# Altium schematic sheet ThePixelExpert_ESP-32-WLED-Board__PCB__Sheet_1_2025-09-09.schdoc
size 303 x 177 mm
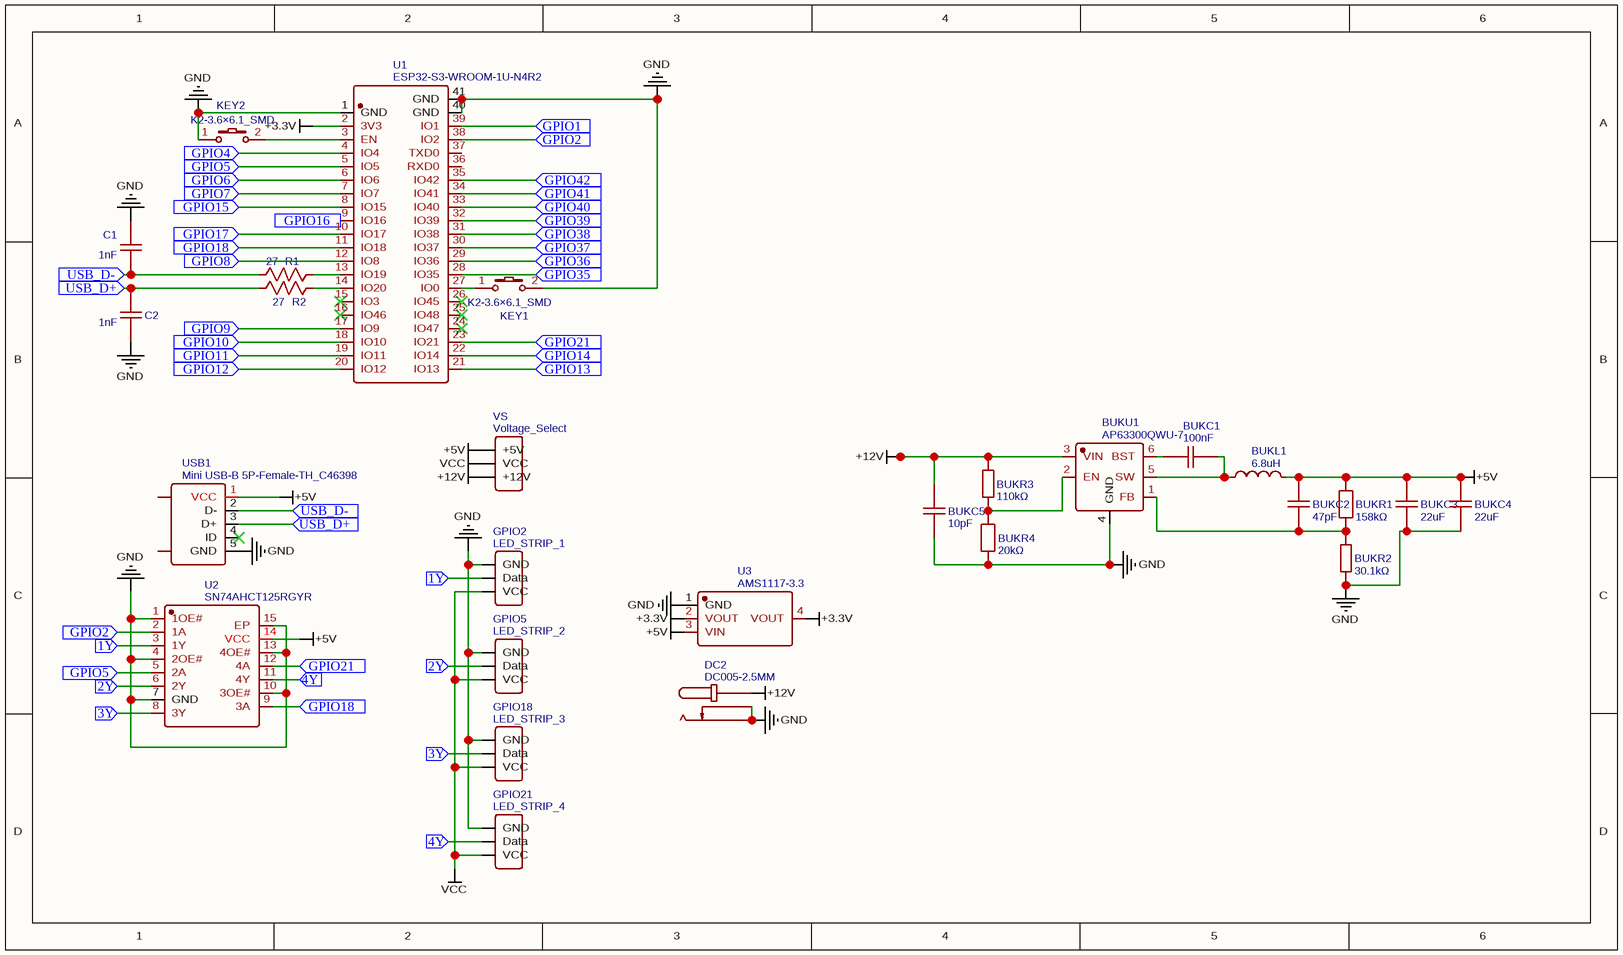
[diagram p0: ThePixelExpert_ESP-32-WLED-Board__PCB__Sheet_1_2025-09-09.schdoc]

## Parts
BUKC1  100nF  [C0603]
BUKC2  47pF  [C0603]
BUKC3  22uF  [C0603]
BUKC4  22uF  [C0603]
BUKC5  10pF  [C0603]
BUKL1  6.8uH  [L0603]
BUKR1  158kΩ  [R0603]
BUKR2  30.1kΩ  [R0603]
BUKR3  110kΩ  [R0603]
BUKR4  20kΩ  [R0603]
BUKU1  AP63300QWU-7  [TSOT-26-6_L2.9-W1.6-P0.95-LS2.8-BR]
C1  1nF  [C0603]
C2  1nF  [C0603]
DC2  DC005-2.5MM  [DC-IN-TH_DC-005-20A-1]
GPIO2  LED_STRIP_1  [5V LED WS2814 CONNECTOR]
GPIO5  LED_STRIP_2  [5V LED WS2814 CONNECTOR]
GPIO18  LED_STRIP_3  [5V LED WS2814 CONNECTOR]
GPIO21  LED_STRIP_4  [5V LED WS2814 CONNECTOR]
KEY1  K2-3.6×6.1_SMD  [KEY-SMD_2P-L6.2-W3.6-LS8.0]
KEY2  K2-3.6×6.1_SMD  [KEY-SMD_2P-L6.2-W3.6-LS8.0]
R1  27  [R0603]
R2  27  [R0603]
U1  ESP32-S3-WROOM-1U-N4R2  [WIRELM-SMD_ESP32-S3-WROOM-1U]
U2  SN74AHCT125RGYR  [VQFN-14_L3.5-W3.5-P0.50-BL-EP]
U3  AMS1117-3.3  [SOT-223-3_L6.5-W3.4-P2.30-LS7.0-BR]
USB1  Mini USB-B 5P-Female-TH_C46398  [MINI-USB-TH_USB-MINI-2]
VS  Voltage_Select  [12/5V VOLTAGE SELECT]

## Ports
1Y (in), 2Y (in), 3Y (in), 4Y (in), GPIO1 (in), GPIO2 (in), GPIO4 (in), GPIO5 (in), GPIO6 (in), GPIO7 (in), GPIO8 (in), GPIO9 (in), GPIO10 (in), GPIO11 (in), GPIO12 (in), GPIO13 (in), GPIO14 (in), GPIO15 (in), GPIO16 (in), GPIO17 (in), GPIO18 (in), GPIO21 (in), GPIO35 (in), GPIO36 (in), GPIO37 (in), GPIO38 (in), GPIO39 (in), GPIO40 (in), GPIO41 (in), GPIO42 (in), USB_D+ (in), USB_D- (in)

## Nets
+3.3V: U1.2(3V3) U3.2(VOUT) U3.4(VOUT)
+5V: BUKC2.2 BUKC3.2 BUKC4.2 BUKL1.2 BUKR1.2 U2.14(VCC) U3.3(VIN) USB1.1(VCC) VS.1(+5V)
+12V: BUKC5.2 BUKR3.1 BUKU1.3(VIN) DC2.1 VS.3(+12V)
GND: BUKC3.1 BUKC4.1 BUKC5.1 BUKR2.1 BUKR4.1 BUKU1.4(GND) C1.2 C2.1 DC2.2 DC2.3 GPIO2.1(GND) GPIO5.1(GND) GPIO18.1(GND) GPIO21.1(GND) KEY1.2 KEY2.1 U1.1(GND) U1.40(GND) U1.41(GND) U2.1(1OE#) U2.4(2OE#) U2.7(GND) U2.10(3OE#) U2.13(4OE#) U2.15(EP) U3.1(GND) USB1.5(GND)
VCC: GPIO2.3(VCC) GPIO5.3(VCC) GPIO18.3(VCC) GPIO21.3(VCC) VS.2(VCC)
1Y: GPIO2.2(Data) U2.3(1Y) ; port 1Y
2Y: GPIO5.2(Data) U2.6(2Y) ; port 2Y
3Y: GPIO18.2(Data) U2.8(3Y) ; port 3Y
4Y: GPIO21.2(Data) U2.11(4Y) ; port 4Y
GPIO1: U1.39(IO1) ; port GPIO1
GPIO2: U1.38(IO2) U2.2(1A) ; port GPIO2
GPIO4: U1.4(IO4) ; port GPIO4
GPIO5: U1.5(IO5) U2.5(2A) ; port GPIO5
GPIO6: U1.6(IO6) ; port GPIO6
GPIO7: U1.7(IO7) ; port GPIO7
GPIO8: U1.12(IO8) ; port GPIO8
GPIO9: U1.17(IO9) ; port GPIO9
GPIO10: U1.18(IO10) ; port GPIO10
GPIO11: U1.19(IO11) ; port GPIO11
GPIO12: U1.20(IO12) ; port GPIO12
GPIO13: U1.21(IO13) ; port GPIO13
GPIO14: U1.22(IO14) ; port GPIO14
GPIO15: U1.8(IO15) ; port GPIO15
GPIO16: U1.9(IO16) ; port GPIO16
GPIO17: U1.10(IO17) ; port GPIO17
GPIO18: U1.11(IO18) U2.9(3A) ; port GPIO18
GPIO21: U1.23(IO21) U2.12(4A) ; port GPIO21
GPIO35: U1.28(IO35) ; port GPIO35
GPIO36: U1.29(IO36) ; port GPIO36
GPIO37: U1.30(IO37) ; port GPIO37
GPIO38: U1.31(IO38) ; port GPIO38
GPIO39: U1.32(IO39) ; port GPIO39
GPIO40: U1.33(IO40) ; port GPIO40
GPIO41: U1.34(IO41) ; port GPIO41
GPIO42: U1.35(IO42) ; port GPIO42
USB_D+: C2.2 R2.1 USB1.3(D+) ; port USB_D+
USB_D-: C1.1 R1.1 USB1.2(D-) ; port USB_D-
NetBUKC1_1: BUKC1.1 BUKU1.6(BST)
NetBUKC1_2: BUKC1.2 BUKL1.1 BUKU1.5(SW)
NetBUKC2_1: BUKC2.1 BUKR1.1 BUKR2.2 BUKU1.1(FB)
NetBUKR3_2: BUKR3.2 BUKR4.2 BUKU1.2(EN)
NetKEY1_1: KEY1.1 U1.27(IO0)
NetKEY2_2: KEY2.2 U1.3(EN)
NetR1_2: R1.2 U1.13(IO19)
NetR2_2: R2.2 U1.14(IO20)

Not connected (* = marked no-connect by the designer): U1 15(IO3)* 16(IO46)* 24(IO47)* 25(IO48)* 26(IO45)* 36(RXD0) 37(TXD0); USB1 0 4(ID)*

## Library data of the parts
BUKC1 = 100nF: Manufacturer: FH(风华); Manufacturer Part: 0603B104J250NT; nameAlias: Value; Contributor: lcsc; Supplier: LCSC; Supplier Part: C2991729; JLCPCB Part Class: Extended Part; spicePre: C; spiceSymbolName: 0603B104J250NT
BUKC2 = 47pF: Manufacturer: AIDE(爱迪电容); Manufacturer Part: 0603C0G470J500NT; nameAlias: Value; Contributor: lcsc; Supplier: LCSC; Supplier Part: C48579260; JLCPCB Part Class: Extended Part; spicePre: C; spiceSymbolName: 0603C0G470J500NT
BUKC3 BUKC4 = 22uF: Manufacturer: Chinocera(华瓷); Manufacturer Part: HGC0603R5226M160NTHJ; nameAlias: Value; Contributor: lcsc; Supplier: LCSC; Supplier Part: C22367828; JLCPCB Part Class: Extended Part; spicePre: C; spiceSymbolName: HGC0603R5226M160NTHJ
BUKC5 = 10pF: Manufacturer: YAGEO(国巨); Manufacturer Part: CC0603FRNPO0BN100; nameAlias: Value; Contributor: lcsc; Supplier: LCSC; Supplier Part: C576764; JLCPCB Part Class: Extended Part; spicePre: C; spiceSymbolName: CC0603FRNPO0BN100
BUKL1 = 6.8uH: Manufacturer: FH(风华); Manufacturer Part: CMP160808JE6R8MT; nameAlias: Value; Contributor: LCSC; Supplier: LCSC; Supplier Part: C395003; JLCPCB Part Class: Extended Part; spicePre: L; spiceSymbolName: CMP160808JE6R8MT
BUKR1 = 158kΩ: Manufacturer: FOJAN(富捷); Manufacturer Part: FRC0603F1583TS; Contributor: lcsc; nameAlias: Value; Supplier: LCSC; Supplier Part: C2974029; JLCPCB Part Class: Extended Part; spicePre: R; spiceSymbolName: FRC0603F1583TS
BUKR2 = 30.1kΩ: Manufacturer: Tyohm(幸亚电阻); Manufacturer Part: RMC060330.1K1%N; nameAlias: Value; Contributor: LCSC; Supplier: LCSC; Supplier Part: C325686; JLCPCB Part Class: Extended Part; spicePre: R; spiceSymbolName: RMC060330.1K1%N
BUKR3 = 110kΩ: Manufacturer: YAGEO(国巨); Manufacturer Part: RT0603BRD07110KL; nameAlias: Value; Contributor: LCSC; Supplier: LCSC; Supplier Part: C326736; JLCPCB Part Class: Extended Part; spicePre: R; spiceSymbolName: RT0603BRD07110KL
BUKR4 = 20kΩ: Manufacturer: YAGEO(国巨); Manufacturer Part: RT0603CRE0720KL; Contributor: LCSC; nameAlias: Value; Supplier: LCSC; Supplier Part: C705914; JLCPCB Part Class: Extended Part; spicePre: R; spiceSymbolName: RT0603CRE0720KL
BUKU1 = AP63300QWU-7: Manufacturer: DIODES(美台); Contributor: lcsc; Supplier: LCSC; Supplier Part: C5248538; Manufacturer Part: AP63300QWU-7; JLCPCB Part Class: Extended Part; spicePre: U; spiceSymbolName: AP63300QWU-7
C1 C2 = 1nF: Manufacturer Part: CL10B102KB8NNNC; Manufacturer: Samsung Electro-Mechanics; nameAlias: Value(F); Contributor: LCEDA_Lib; Supplier Part: C1588; Supplier: JLCPCB; spicePre: C; spiceSymbolName: C_0603_US
DC2 = DC005-2.5MM: Manufacturer: SOFNG(硕方); Manufacturer Part: DC005-T25; Supplier: LCSC; Supplier Part: C111573; JLCPCB Part Class: Extended Part; spicePre: D; spiceSymbolName: DC005-2.5MM
GPIO2 = LED_STRIP_1: Manufacturer: BOOMELE(博穆精密); Manufacturer Part: 2.54-1*3P针; Supplier: LCSC; Supplier Part: C49257; JLCPCB Part Class: Extended Part; spicePre: H; spiceSymbolName: Header-Male-2.54_1x3
GPIO5 = LED_STRIP_2: Manufacturer: BOOMELE(博穆精密); Manufacturer Part: 2.54-1*3P针; Supplier: LCSC; Supplier Part: C49257; JLCPCB Part Class: Extended Part; spicePre: H; spiceSymbolName: Header-Male-2.54_1x3
GPIO18 = LED_STRIP_3: Manufacturer: BOOMELE(博穆精密); Manufacturer Part: 2.54-1*3P针; Supplier: LCSC; Supplier Part: C49257; JLCPCB Part Class: Extended Part; spicePre: H; spiceSymbolName: Header-Male-2.54_1x3
GPIO21 = LED_STRIP_4: Manufacturer: BOOMELE(博穆精密); Manufacturer Part: 2.54-1*3P针; Supplier: LCSC; Supplier Part: C49257; JLCPCB Part Class: Extended Part; spicePre: H; spiceSymbolName: Header-Male-2.54_1x3
KEY1 KEY2 = K2-3.6×6.1_SMD: Manufacturer Part: K2-1107ST-A4SW-06; Contributor: LCEDA_Lib; 制造商: 韩国韩荣; Supplier Part: C118141; Supplier: LCSC; spicePre: K; spiceSymbolName: K2-3.6×6.1_SMD
R1 R2 = 27: Manufacturer Part: 0603WAF270JT5E; Manufacturer: UNI-ROYAL(Uniroyal Elec); nameAlias: Value(Ω); Contributor: LCEDA_Lib; Supplier Part: C25190; Supplier: JLCPCB; spicePre: R; spiceSymbolName: R_0603_US
U1 = ESP32-S3-WROOM-1U-N4R2: Manufacturer: ESPRESSIF(乐鑫); Contributor: lcsc; Supplier: LCSC; Supplier Part: C3013942; Manufacturer Part: ESP32-S3-WROOM-1U-N4R2; JLCPCB Part Class: Extended Part; spicePre: U; spiceSymbolName: ESP32-S3-WROOM-1U-N4R2
U2 = SN74AHCT125RGYR: Manufacturer: TI(德州仪器); Contributor: LCSC; Supplier: LCSC; Supplier Part: C2675532; Manufacturer Part: SN74AHCT125RGYR; JLCPCB Part Class: Extended Part; spicePre: U; spiceSymbolName: SN74AHCT125RGYR
U3 = AMS1117-3.3: Manufacturer: AMS; sourceId: dwIGgezVh; timeStamp: 1476261164; Supplier: LCSC; Manufacturer Part: AMS1117-3.3; Supplier Part: C6186; JLCPCB Part Class: Basic Part; spicePre: U; spiceSymbolName: AMS1117-3.3
USB1 = Mini USB-B 5P-Female-TH_C46398: Manufacturer: 精拓金; Manufacturer Part: 920-462A2021D10102; Supplier: LCSC; Supplier Part: C46398; JLCPCB Part Class: Extended Part; spicePre: U; spiceSymbolName: Mini USB-B 5P-Female-TH_C46398
VS = Voltage_Select: Manufacturer: BOOMELE(博穆精密); Manufacturer Part: 2.54-1*3P针; Supplier: LCSC; Supplier Part: C49257; JLCPCB Part Class: Extended Part; spicePre: H; spiceSymbolName: Header-Male-2.54_1x3